# EAGLE design hw-demo03 (EAGLE 7.3.0)
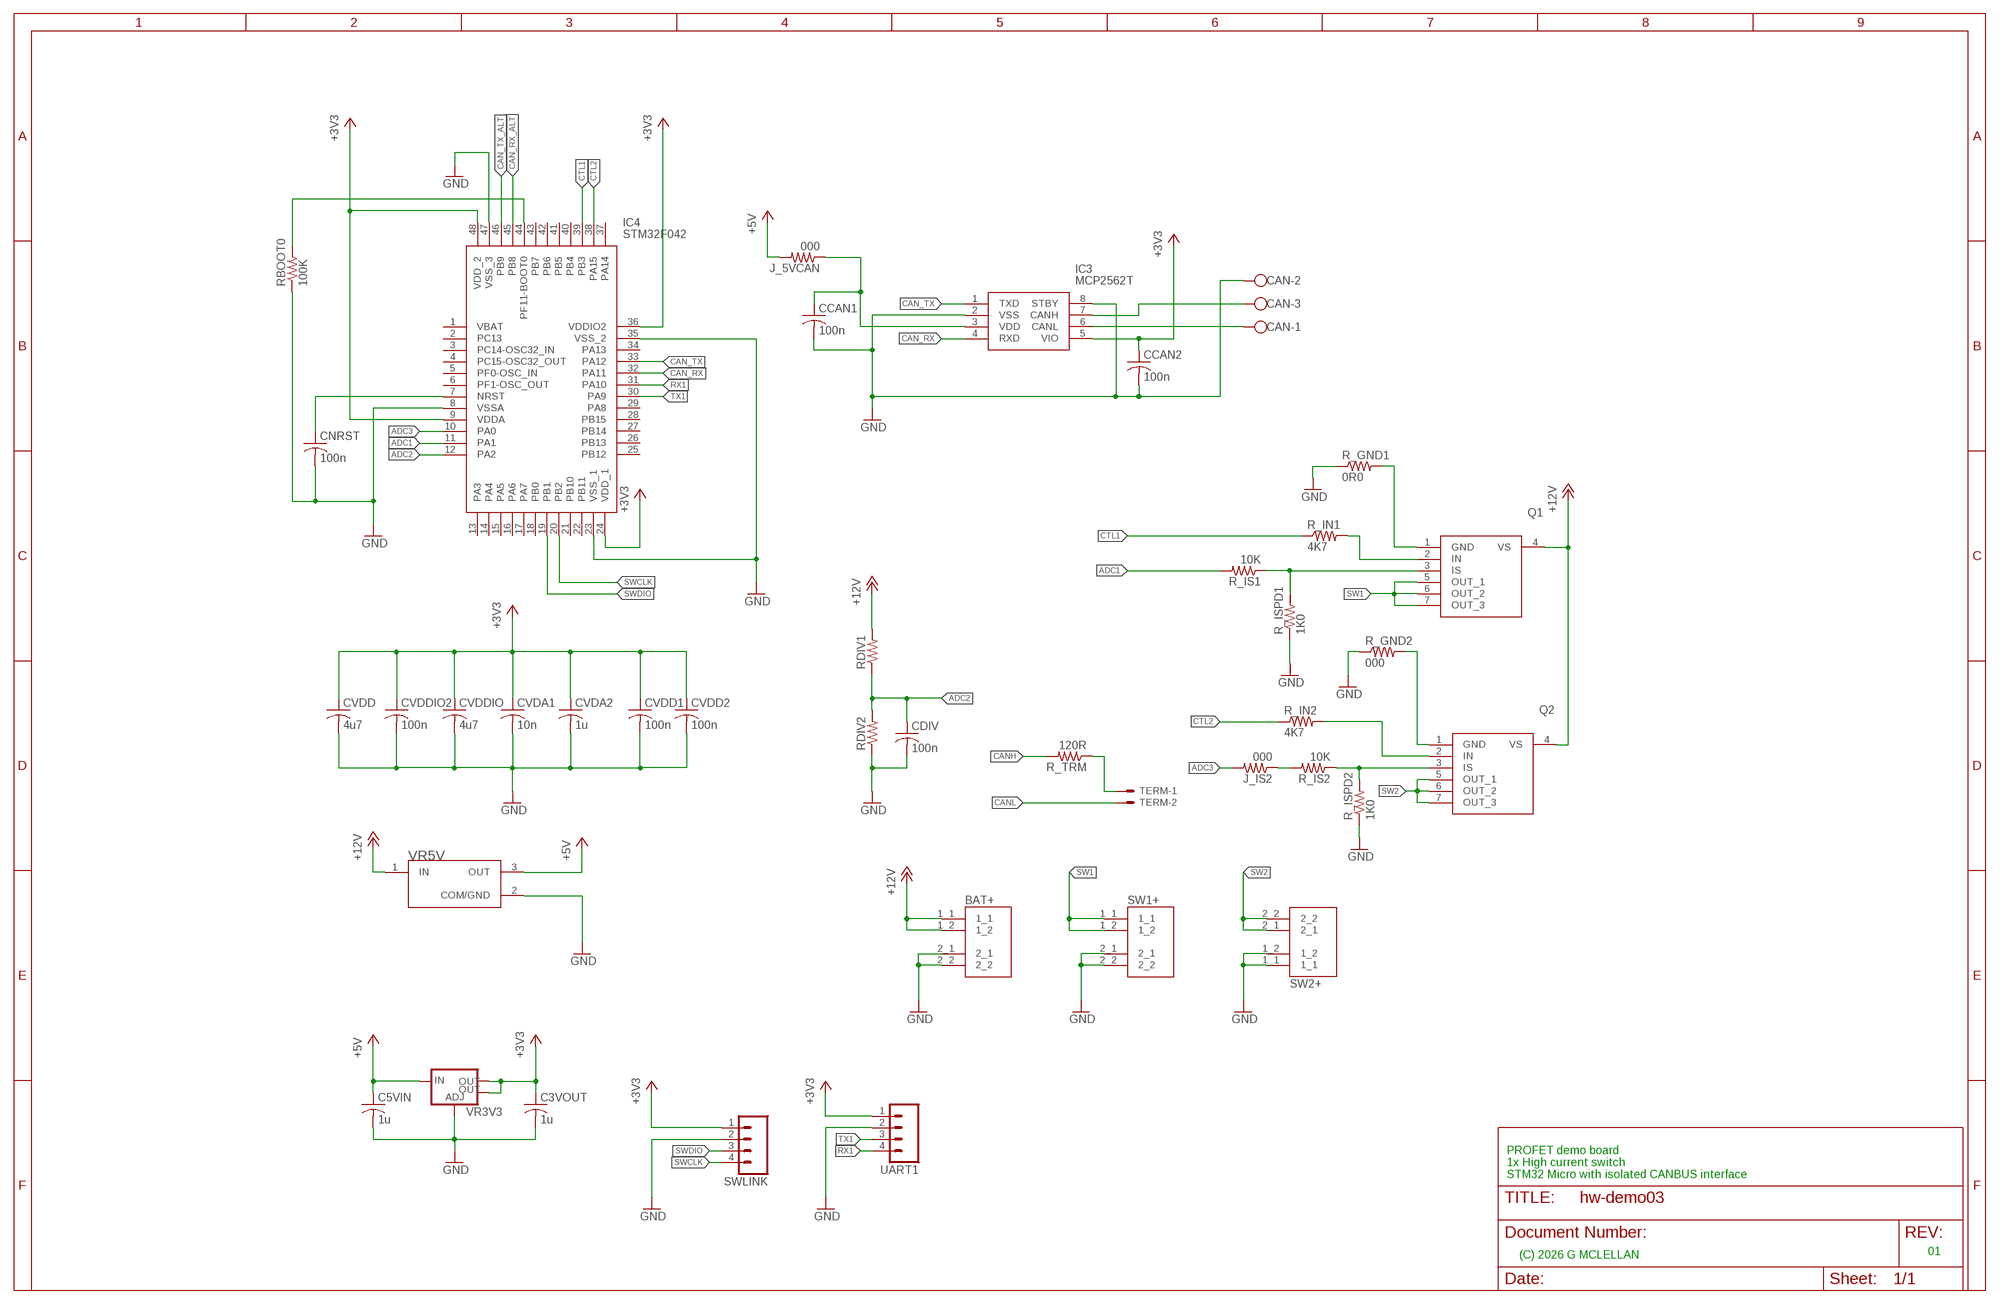
[diagram p0: schematic, sheet 1]

## Parts
BAT+  VP0265840000G  [AMPHENOL_VP0265840000G]
C3VOUT  1u  C-USC0805K  [C0805K]
C5VIN  1u  C-USC1206K  [C1206K]
CAN  W237-103  [W237-103]
CCAN1  100n  C-USC0603K  [C0603K]
CCAN2  100n  C-USC0603K  [C0603K]
CDIV  100n  C-USC0603K  [C0603K]
CNRST  100n  C-USC0603K  [C0603K]
CVDA1  10n  C-USC0603K  [C0603K]
CVDA2  1u  C-USC0603K  [C0603K]
CVDD  4u7  C-USC0603K  [C0603K]
CVDD1  100n  C-USC0603K  [C0603K]
CVDD2  100n  C-USC0603K  [C0603K]
CVDDIO  4u7  C-USC0603K  [C0603K]
CVDDIO2  100n  C-USC0603K  [C0603K]
IC3  MCP2562T  MCP2562T-H_SN  [SOIC127P600X175-8N]
IC4  STM32F042  STM32F042C6T7  [QFP50P900X900X160-48N]
J_5VCAN  000  R-US_0207/15  [0207/15]
J_IS2  000  R-US_0207/15  [0207/15]
Q1  BTS500101TADATMA2  [BTS500101TADATMA2]
Q2  BTS500101TADATMA2  [BTS500101TADATMA2]
R_GND1  0R0  R-US_R1206W  [R1206W]
R_GND2  000  R-US_R1206W  [R1206W]
R_IN1  4K7  R-US_0207/10  [0207/10]
R_IN2  4K7  R-US_0204/7  [0204/7]
R_IS1  10K  R-US_0204/7  [0204/7]
R_IS2  10K  R-US_0204/7  [0204/7]
R_ISPD1  1K0  R-US_0204/7  [0204/7]
R_ISPD2  1K0  R-US_0204/7  [0204/7]
R_TRM  120R  R-US_0204/7  [0204/7]
RBOOT0  100K  R-US_R0603  [R0603]
RDIV1  R-US_R0805  [R0805]
RDIV2  R-US_R0805  [R0805]
SW1+  VP0265840000G  [AMPHENOL_VP0265840000G]
SW2+  VP0265840000G  [AMPHENOL_VP0265840000G]
SWLINK  M04LOCK  [1X04_LOCK]
TERM  22-23-2021  [22-23-2021]
UART1  M04LOCK  [1X04_LOCK]
VR3V3  V_REG_LM1117SOT223  [SOT223]
VR5V  OKI-78SR-5/1.5-W36-C  [CONV_OKI-78SR-5/1.5-W36-C]

## Nets
+3V3: C3VOUT.1 CCAN2.1 CVDA1.1 CVDA2.1 CVDD1.1 CVDD2.1 CVDD.1 CVDDIO2.1 CVDDIO.1 IC3.5(VIO) IC4.9(VDDA) IC4.24(VDD_1) IC4.36(VDDIO2) IC4.48(VDD_2) SWLINK.1 UART1.1 VR3V3.2(OUT) VR3V3.4(OUT)
+5V: C5VIN.1 J_5VCAN.2 VR3V3.3(IN) VR5V.3(OUT)
+12V: BAT+.1_1 BAT+.1_2 Q1.4(VS) Q2.4(VS) RDIV1.2 VR5V.1(IN)
ADC1: IC4.11(PA1) R_IS1.2
ADC2: CDIV.1 IC4.12(PA2) RDIV1.1 RDIV2.2
ADC3: IC4.10(PA0) J_IS2.2
BOOT0: IC4.44(PF11-BOOT0) RBOOT0.2
CAN_RX: IC3.4(RXD) IC4.32(PA11)
CAN_RX_ALT: IC4.45(PB8)
CAN_TX: IC3.1(TXD) IC4.33(PA12)
CAN_TX_ALT: IC4.46(PB9)
CANH: CAN.3 IC3.7(CANH) R_TRM.2
CANL: CAN.1 IC3.6(CANL) TERM.2
CTL1: IC4.39(PB3) R_IN1.1
CTL2: IC4.38(PA15) R_IN2.1
CTL3`: Q1.2(IN) R_IN1.2
GND: BAT+.2_1 BAT+.2_2 C3VOUT.2 C5VIN.2 CAN.2 CCAN1.2 CCAN2.2 CDIV.2 CNRST.2 CVDA1.2 CVDA2.2 CVDD1.2 CVDD2.2 CVDD.2 CVDDIO2.2 CVDDIO.2 IC3.2(VSS) IC3.8(STBY) IC4.8(VSSA) IC4.23(VSS_1) IC4.35(VSS_2) IC4.47(VSS_3) R_GND1.1 R_GND2.1 R_ISPD1.1 R_ISPD2.1 RBOOT0.1 RDIV2.1 SW1+.2_1 SW1+.2_2 SW2+.1_1 SW2+.1_2 SWLINK.2 UART1.2 VR3V3.1(ADJ) VR5V.2(COM/GND)
IS: Q1.3(IS) R_IS1.1 R_ISPD1.2
N$1: R_TRM.1 TERM.1
N$2: J_IS2.1 R_IS2.2
N$3: Q1.1(GND) R_GND1.2
N$4: Q2.1(GND) R_GND2.2
N$5: Q2.2(IN) R_IN2.2
N$6: Q2.3(IS) R_IS2.1 R_ISPD2.2
N$7: CCAN1.1 IC3.3(VDD) J_5VCAN.1
N$8: CNRST.1 IC4.7(NRST)
RX1: IC4.31(PA10) UART1.4
SW1: Q1.5(OUT_1) Q1.6(OUT_2) Q1.7(OUT_3) SW1+.1_1 SW1+.1_2
SW2: Q2.5(OUT_1) Q2.6(OUT_2) Q2.7(OUT_3) SW2+.2_1 SW2+.2_2
SWCLK: IC4.20(PB2) SWLINK.4
SWDIO: IC4.19(PB1) SWLINK.3
TX1: IC4.30(PA9) UART1.3
Unconnected: IC4.1(VBAT) IC4.2(PC13) IC4.3(PC14-OSC32_IN) IC4.4(PC15-OSC32_OUT) IC4.5(PF0-OSC_IN) IC4.6(PF1-OSC_OUT) IC4.13(PA3) IC4.14(PA4) IC4.15(PA5) IC4.16(PA6) IC4.17(PA7) IC4.18(PB0) IC4.21(PB10) IC4.22(PB11) IC4.25(PB12) IC4.26(PB13) IC4.27(PB14) IC4.28(PB15) IC4.29(PA8) IC4.34(PA13) IC4.37(PA14) IC4.40(PB4) IC4.41(PB5) IC4.42(PB6) IC4.43(PB7)

## Notes on the sheet
- PROFET demo board
  1x High current switch
  STM32 Micro with isolated CANBUS interface
- 01
- (C) 2026 G MCLELLAN

## Library data of the parts
BAT+ SW1+ SW2+ = VP0265840000G:VP0265840000G; MANUFACTURER: Amphenol Anytek; MAXIMUM_PACKAGE_HEIGHT: 28.5mm; PARTREV: J; STANDARD: Manufacturer Recommendations
C3VOUT C5VIN CCAN1 CCAN2 CDIV CNRST CVDA1 CVDA2 CVDD CVDD1 CVDD2 CVDDIO CVDDIO2 = rcl:C-US: CAPACITOR, American symbol
CAN = con-wago-500:W237-103: WAGO SCREW CLAMP; MPN: 237-103; OC_FARNELL: unknown; OC_NEWARK: 18M7116
IC3 = MCP2562T-H_SN:MCP2562T-H_SN: CAN Interface IC Source: Datasheet <https://componentsearchengine.com/Datasheets/1/MCP2562T-H_SN.pdf>; DESCRIPTION: CAN Interface IC; HEIGHT: 1.75mm; MANUFACTURER_NAME: Microchip; MANUFACTURER_PART_NUMBER: MCP2562T-H/SN; MOUSER_PART_NUMBER: 579-MCP2562T-H/SN; MOUSER_PRICE-STOCK: https://www.mouser.co.uk/ProductDetail/Microchip-Technology/MCP2562T-H-SN?qs=eTPcRhULBzwloCb8Xxk0jQ%3D%3D
IC4 = STM32F042C6T7:STM32F042C6T7: Mainstream Arm Cortex-M0 USB line MCU with 32 Kbytes of Flash memory, 48 MHz CPU, USB, CAN and CEC functions Source: Datasheet <https://www.st.com/resource/en/datasheet/stm32f042c4.pdf>; DESCRIPTION: Mainstream Arm Cortex-M0 USB line MCU with 32 Kbytes of Flash memory, 48 MHz CPU, USB, CAN and CEC functions; HEIGHT: 1.6mm; MANUFACTURER_NAME: STMicroelectronics; MANUFACTURER_PART_NUMBER: STM32F042C6T7; MOUSER_PART_NUMBER: 511-STM32F042C6T7; MOUSER_PRICE-STOCK: https://www.mouser.co.uk/ProductDetail/STMicroelectronics/STM32F042C6T7?qs=PqoDHHvF6499eidad5TESA%3D%3D
J_5VCAN J_IS2 R_GND1 R_GND2 R_IN1 R_IN2 R_IS1 R_IS2 R_ISPD1 R_ISPD2 R_TRM RBOOT0 RDIV1 RDIV2 = rcl:R-US_: RESISTOR, American symbol
Q1 Q2 = BTS500101TADATMA2:BTS500101TADATMA2: Power Switch ICs - Power Distribution MULTICHIP PROFET & GD Source: Datasheet <https://www.infineon.com/assets/row/public/packages/202/footprint_download/infineon-pg-to263-7-10-fpd-pdf-footprint-en.pdf>; DESCRIPTION: Power Switch ICs - Power Distribution MULTICHIP PROFET & GD; HEIGHT: 4.5mm; MANUFACTURER_NAME: Infineon; MANUFACTURER_PART_NUMBER: BTS500101TADATMA2; MOUSER_PART_NUMBER: 726-BTS500101TADATM2; MOUSER_PRICE-STOCK: https://www.mouser.co.uk/ProductDetail/Infineon-Technologies/BTS500101TADATMA2?qs=l7cgNqFNU1huaQviZWv9NQ%3D%3D
SWLINK UART1 = SparkFun-Connectors:M04: Header 4 Standard 4-pin 0.1" header. Use with straight break away headers (SKU : PRT-00116), right angle break away headers (PRT-00553), swiss pins (PRT-00743), machine pins (PRT-00117), and female headers (PRT-00115). Molex polarized connector foot print use with SKU : PRT-08231 with associated crimp pins and housings. 1MM SMD Version SKU: PRT-10208; PROD_ID: CONN-09696
TERM = con-molex:22-23-2021: .100" (2.54mm) Center Header - 2 Pin; MF: MOLEX; MPN: 22-23-2021; OC_FARNELL: 1462926; OC_NEWARK: 25C3832
VR3V3 = SparkFun-PowerIC:V_REG_LM1117: Voltage Regulator LM1117 Standard adjustable voltage regulator but in SMD form. Spark Fun Electronics SKU : COM-00595; PROD_ID: VREG-08170
VR5V = OKI-78SR-5_1.5-W36-C:OKI-78SR-5/1.5-W36-C; MANUFACTURER: Murata; MAXIMUM_PACKAGE_HEIGHT: 16.5mm; STANDARD: Manufacturer recommendations

## Board
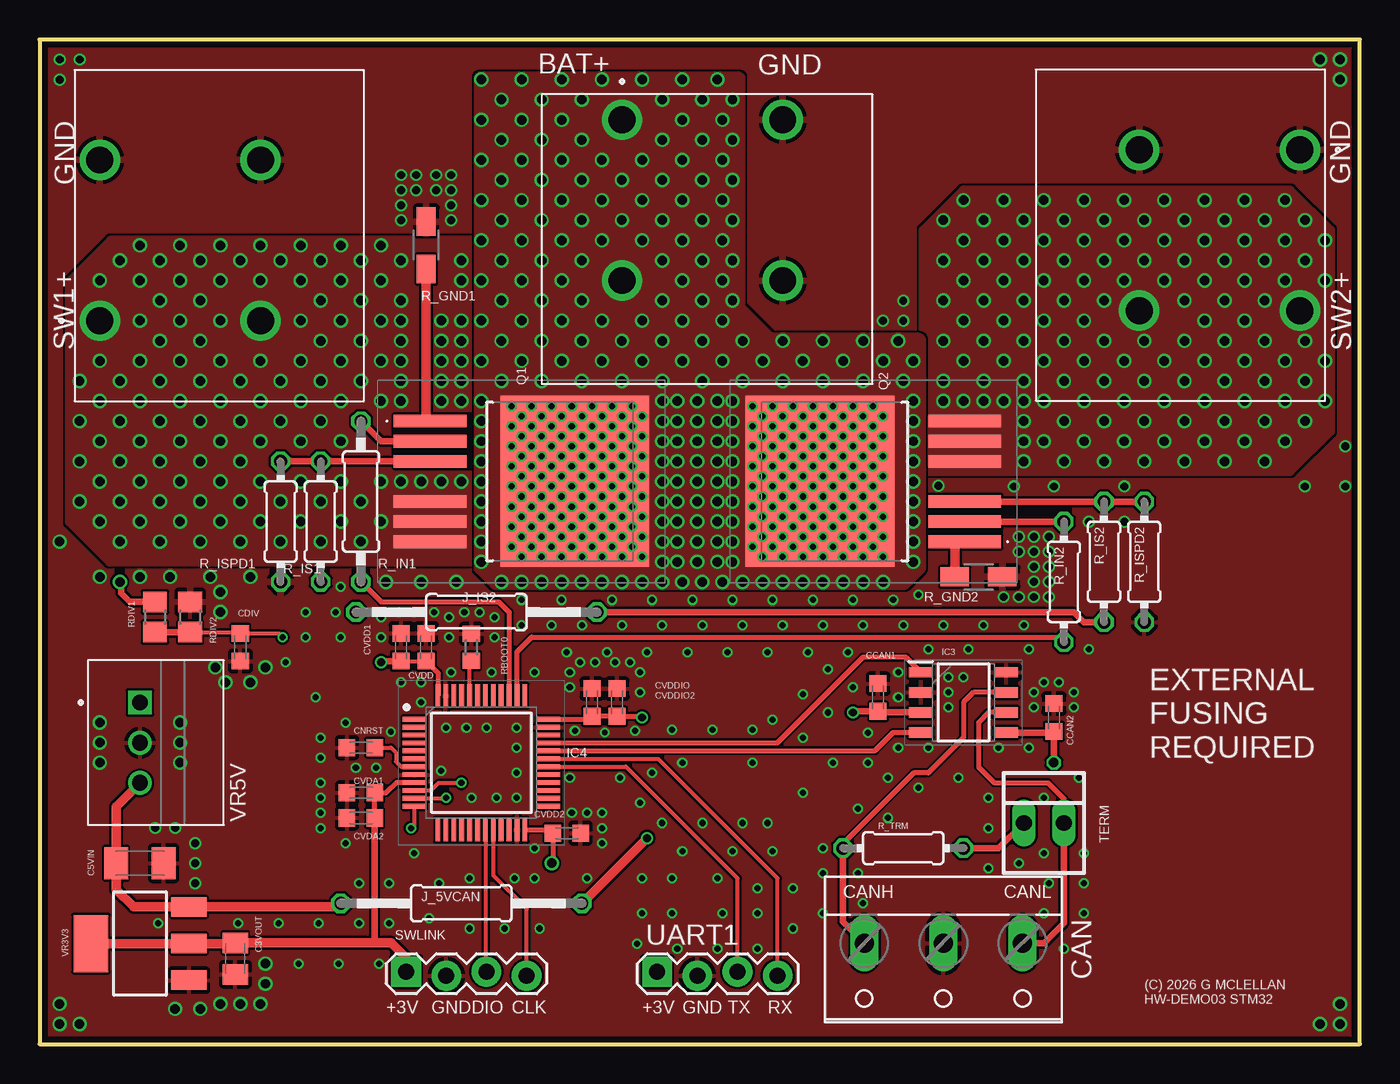
[diagram p1: board, top side]
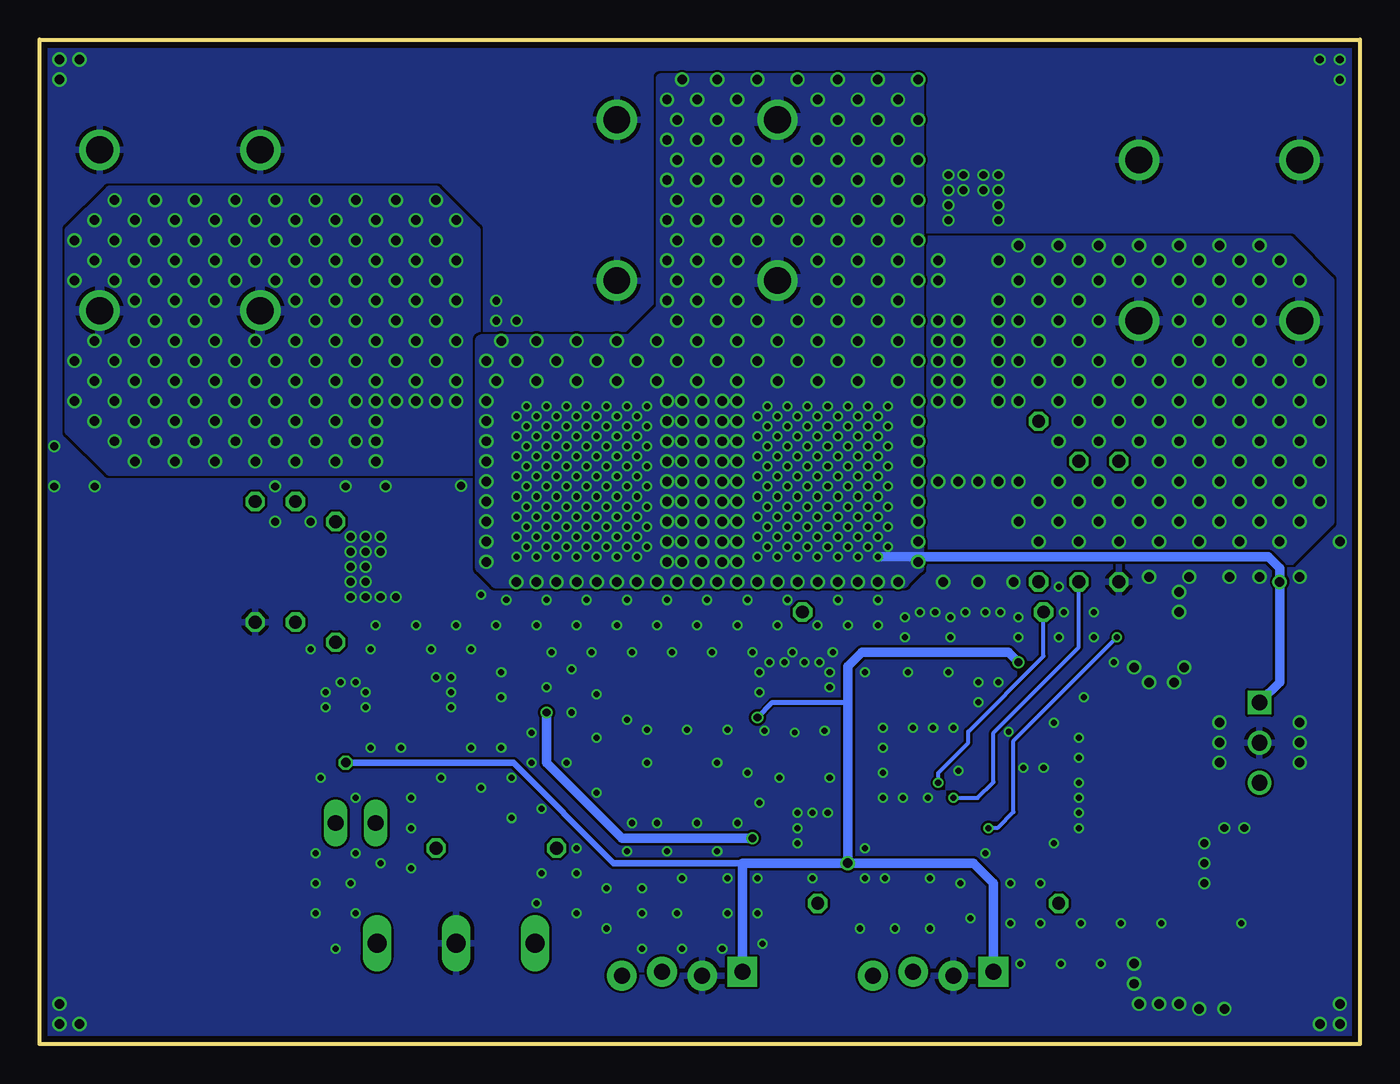
[diagram p2: board, bottom side, seen from below]

Size 83.49 x 63.49 mm. Coordinates in mm from the lower left corner, seen from the top.
Outline: 0,0 83.49,0 83.49,63.49 0,63.49 0,0
Copper layers (1*16): Top 0.035559375mm / dielectric 1.6mm / Bottom 0.035559375mm
Design rules "oshpark-2layer": minimum track width 6mil, minimum drill 10mil, track to track 6mil, track to pad 6mil, pad to pad 6mil, via to via 6mil, smd to smd 6mil, copper to edge 15mil, drill to drill 6mil, minimum pad ring 5mil, minimum via ring 5mil, stop-mask expansion 2.5mil, vias tented up to drill 0mil, thermal gap 10mil

### Footprints (pad centres in the part's own frame; a part is rotated, then mirrored left to right if it is on the bottom)
AMPHENOL_VP0265840000G = drill 1.7: 1_1 -5.08,5.08; 1_2 -5.08,-5.08; 2_1 5.08,5.08; 2_2 5.08,-5.08
C0805K = smd 1.3 x 1.6: 1 -1,0; 2 1,0
C1206K = smd 1.5 x 2: 1 -1.5,0; 2 1.5,0
W237-103 = drill 1.194 long: 1 -5,-1.29; 2 0,-1.29; 3 5,-1.29
C0603K = smd 1.05 x 1.08: 1 -0.875,0; 2 0.875,0
SOIC127P600X175-8N = smd 1.5 x 0.65: 1 -2.7,1.905; 2 -2.7,0.635; 3 -2.7,-0.635; 4 -2.7,-1.905; 5 2.7,-1.905; 6 2.7,-0.635; 7 2.7,0.635; 8 2.7,1.905
QFP50P900X900X160-48N = smd 1.475 x 0.3: 1 -4.238,2.75; 2 -4.238,2.25; 3 -4.238,1.75; 4 -4.238,1.25; 5 -4.238,0.75; 6 -4.238,0.25; 7 -4.238,-0.25; 8 -4.238,-0.75; 9 -4.238,-1.25; 10 -4.238,-1.75; 11 -4.238,-2.25; 12 -4.238,-2.75; 25 4.238,-2.75; 26 4.238,-2.25; 27 4.238,-1.75; 28 4.238,-1.25; 29 4.238,-0.75; 30 4.238,-0.25; 31 4.238,0.25; 32 4.238,0.75; 33 4.238,1.25; 34 4.238,1.75; 35 4.238,2.25; 36 4.238,2.75 | smd 0.3 x 1.475: 13 -2.75,-4.238; 14 -2.25,-4.238; 15 -1.75,-4.238; 16 -1.25,-4.238; 17 -0.75,-4.238; 18 -0.25,-4.238; 19 0.25,-4.238; 20 0.75,-4.238; 21 1.25,-4.238; 22 1.75,-4.238; 23 2.25,-4.238; 24 2.75,-4.238; 37 2.75,4.238; 38 2.25,4.238; 39 1.75,4.238; 40 1.25,4.238; 41 0.75,4.238; 42 0.25,4.238; 43 -0.25,4.238; 44 -0.75,4.238; 45 -1.25,4.238; 46 -1.75,4.238; 47 -2.25,4.238; 48 -2.75,4.238
0207/15 = drill 0.813 octagon: 1 -7.62,0; 2 7.62,0
BTS500101TADATMA2 = smd 0.8 x 4.6: 1 -3.81,-6.425; 2 -2.54,-6.425; 3 -1.27,-6.425; 5 1.27,-6.425; 6 2.54,-6.425; 7 3.81,-6.425 | smd 10.8 x 9.4: 4 0,2.725
R1206W = smd 1.8 x 1.2: 1 -1.499,0; 2 1.499,0
0207/10 = drill 0.813 octagon: 1 -5.08,0; 2 5.08,0
0204/7 = drill 0.813 octagon: 1 -3.81,0; 2 3.81,0
R0603 = smd 1 x 1.1: 1 -0.85,0; 2 0.85,0
R0805 = smd 1.3 x 1.5: 1 -0.95,0; 2 0.95,0
1X04_LOCK = drill 1.016 pad 1.88 square: 1 0,0.127 | drill 1.016 pad 1.88: 2 2.54,-0.127; 3 5.08,0.127; 4 7.62,-0.127
22-23-2021 = drill 1 long: 1 -1.27,0; 2 1.27,0
SOT223 = smd 1.219 x 2.235: 1 -2.311,-3.099; 2 0,-3.099; 3 2.311,-3.099 | smd 3.6 x 2.2: 4 0,3.099
CONV_OKI-78SR-5/1.5-W36-C = drill 1 pad 1.5 square: 1 -2.54,0 | drill 1 pad 1.5: 2 0,0; 3 2.54,0

### Placement (x,y rotation side)
BAT+  41.91,53.34 0 top
C3VOUT  12.38,5.4 270 top
C5VIN  6.35,11.43 0 top
CAN  57.15,5.08 180 top
CCAN1  53.02,21.91 90 top
CCAN2  64.14,20.64 90 top
CDIV  12.7,25.08 270 top
CNRST  20.32,18.73 180 top
CVDA1  20.32,15.88 180 top
CVDA2  20.32,14.29 180 top
CVDD  24.45,25.08 90 top
CVDD1  22.86,25.08 90 top
CVDD2  33.34,13.34 0 top
CVDDIO  36.51,21.59 90 top
CVDDIO2  34.92,21.59 90 top
IC3  58.42,21.59 0 top
IC4  27.94,17.78 0 top
J_5VCAN  26.67,8.89 180 top
J_IS2  27.62,27.3 180 top
Q1  31.11,35.56 270 top
Q2  52.07,35.56 90 top
R_GND1  24.45,50.48 270 top
R_GND2  59.37,29.53 180 top
R_IN1  20.32,34.29 90 top
R_IN2  64.77,29.21 90 top
R_IS1  17.78,33.02 270 top
R_IS2  67.31,30.48 270 top
R_ISPD1  15.24,33.02 90 top
R_ISPD2  69.85,30.48 90 top
R_TRM  54.61,12.38 180 top
RBOOT0  27.3,25.08 270 top
RDIV1  7.3,26.99 90 top
RDIV2  9.53,26.99 270 top
SW1+  8.89,50.8 90 top
SW2+  74.61,51.44 270 top
SWLINK  23.18,4.45 0 top
TERM  63.5,13.97 0 top
UART1  39.05,4.45 0 top
VR3V3  6.35,6.35 90 top
VR5V  6.35,19.05 270 top

### Tracks (layer width: path | path; a pad name or v marks a point on that pad's centre or on a via)
+3V3  (via drill 0.5, 0.6)
  Top 0.254: CVDD1.1 CVDD.1
  Top 0.305: IC4.24 32.26,13.54 CVDD2.1 32.46,11.51 v32.38,11.43 | IC4.9 22.56,16.53 21.91,15.88 CVDA1.1 CVDA2.1 | CVDD.1 25.19,23.46 IC4.48 | 34.74,20.53 CVDDIO2.1 | CVDDIO2.1 CVDDIO.1 38.1,20.71 v38.1,20.64 | IC4.36 34.92,20.53 CVDDIO2.1
  Top 0.406: CVDD2.1 32.38,13.34 | v64.14,17.78 CCAN2.1 64.06,19.68 IC3.5 | 9.45,6.27 VR3V3.2 | CVDA2.1 21.2,6.4 21.59,6.4 | CVDD1.1 21.59,24.21 v21.59,24.13
  Top 0.61: VR3V3.4 VR3V3.2 12.38,6.35 C3VOUT.1 21.59,6.4 22.25,6.4 23.18,5.46 SWLINK.1
  Bottom 0.305: v38.1,20.64 37.15,21.59 32.38,21.59
  Bottom 0.406: 39.05,11.43 47.18,11.43 53.53,17.78 v64.14,17.78
  Bottom 0.61: v32.38,11.43 24.45,11.43 23.18,10.16 SWLINK.1 | v32.38,11.43 39.05,11.43 UART1.1 | v32.38,11.43 32.38,21.59 32.38,23.87 31.49,24.77 22.23,24.77 v21.59,24.13
+5V
  Top 0.61: J_5VCAN.2 18.82,8.66 VR3V3.3 5.94,8.66 4.85,9.76 C5VIN.1 4.85,15.01 VR5V.3
+12V  (via drill 0.38, 0.6)
  Top 0.305: RDIV1.2
  Top 0.406: 5.17,29.21 5.17,28.49 5.71,27.94 RDIV1.2
  Top 0.61: v5.08,29.21 5.17,29.21
  Bottom 0.61: v30.48,30.8 5.79,30.8 5.08,30.09 v5.08,29.21 5.08,22.86 VR5V.1
  other vias: 29.21,59.69 31.75,59.69 34.29,59.69 39.37,59.69 41.91,59.69 43.18,58.42 40.64,58.42 33.02,58.42 30.48,58.42 29.21,57.15 31.75,57.15 34.29,57.15 39.37,57.15 41.91,57.15 43.18,55.88 40.64,55.88 38.1,55.88 35.56,55.88 33.02,55.88 30.48,55.88 29.21,54.61 31.75,54.61 34.29,54.61 36.83,54.61 39.37,54.61 41.91,54.61 43.18,53.34 40.64,53.34 38.1,53.34 35.56,53.34 33.02,53.34 30.48,53.34 29.21,52.07 31.75,52.07 34.29,52.07 36.83,52.07 39.37,52.07 41.91,52.07 43.18,50.8 40.64,50.8 38.1,50.8 35.56,50.8 33.02,50.8 30.48,50.8 29.21,49.53 31.75,49.53 34.29,49.53 39.37,49.53 41.91,49.53 43.18,48.26 40.64,48.26 33.02,48.26 30.48,48.26 29.21,46.99 31.75,46.99 34.29,46.99 39.37,46.99 41.91,46.99 43.18,45.72 40.64,45.72 38.1,45.72 35.56,45.72 33.02,45.72 30.48,45.72 29.21,44.45 31.75,44.45 34.29,44.45 36.83,44.45 39.37,44.45 41.91,44.45 44.45,44.45 30.48,43.18 33.02,43.18 35.56,43.18 38.1,43.18 40.64,43.18 43.18,43.18 45.72,43.18 48.26,43.18 50.8,43.18 53.34,43.18 54.61,41.91 52.07,41.91 49.53,41.91 46.99,41.91 44.45,41.91 41.91,41.91 39.37,41.91 36.83,41.91 34.29,41.91 31.75,41.91 29.21,41.91 40.32,40.64 39.37,39.37 39.37,40.64 42.86,40.64 42.86,39.37 41.59,40.64 40.32,39.37 41.59,39.37 43.81,40.64 43.81,39.37 39.37,38.1 39.37,36.83 39.37,35.56 39.37,34.29 39.37,33.02 39.37,31.75 39.37,30.48 40.32,30.48 41.59,30.48 42.86,30.48 42.86,31.75 41.59,31.75 40.32,31.75 40.32,33.02 41.59,33.02 42.86,33.02 42.86,34.29 41.59,34.29 40.32,34.29 40.32,35.56 41.59,35.56 42.86,35.56 42.86,36.83 41.59,36.83 40.32,36.83 40.32,38.1 41.59,38.1 42.86,38.1 43.81,38.1 43.81,36.83 43.81,35.56 43.81,34.29 43.81,33.02 43.81,31.75 43.81,30.48 55.24,30.48 55.24,31.75 55.24,33.02 55.24,34.29 55.24,35.56 55.24,36.83 55.24,38.1 55.24,39.37 55.24,40.64 27.94,40.64 27.94,39.37 27.94,38.1 27.94,36.83 27.94,35.56 27.94,34.29 27.94,33.02 27.94,31.75 27.94,30.48 29.21,29.21 30.48,29.21 31.75,29.21 33.02,29.21 34.29,29.21 35.56,29.21 36.83,29.21 38.1,29.21 39.37,29.21 40.64,29.21 41.91,29.21 43.18,29.21 44.45,29.21 45.72,29.21 46.99,29.21 48.26,29.21 49.53,29.21 50.8,29.21 52.07,29.21 53.34,29.21 55.24,43.18 29.84,40.32 31.11,40.32 32.38,40.32 33.65,40.32 34.92,40.32 36.2,40.32 37.46,40.32 36.83,39.69 35.56,39.69 34.29,39.69 33.02,39.69 31.75,39.69 30.48,39.69 29.84,39.05 31.11,39.05 32.38,39.05 33.65,39.05 34.92,39.05 36.2,39.05 37.46,39.05 38.1,39.69 38.1,38.42 36.83,38.42 35.56,38.42 34.29,38.42 33.02,38.42 31.75,38.42 30.48,38.42 29.84,37.78 31.11,37.78 32.38,37.78 33.65,37.78 34.92,37.78 36.2,37.78 37.46,37.78 38.1,37.15 36.83,37.15 35.56,37.15 34.29,37.15 33.02,37.15 31.75,37.15 30.48,37.15 29.84,36.51 31.11,36.51 32.38,36.51 33.65,36.51 34.92,36.51 36.2,36.51 37.46,36.51 38.1,35.88 36.83,35.88 35.56,35.88 34.29,35.88 33.02,35.88 31.75,35.88 30.48,35.88 37.46,35.24 38.1,34.61 36.2,35.24 36.83,34.61 35.56,34.61 34.92,35.24 33.65,35.24 34.29,34.61 32.38,35.24 33.02,34.61 31.11,35.24 31.75,34.61 30.48,34.61 29.84,35.24 29.84,33.97 31.11,33.97 32.38,33.97 33.65,33.97 34.92,33.97 36.2,33.97 37.46,33.97 38.1,33.34 36.83,33.34 35.56,33.34 34.29,33.34 33.02,33.34 31.75,33.34 30.48,33.34 29.84,32.7 31.11,32.7 32.38,32.7 33.65,32.7 34.92,32.7 36.2,32.7 37.46,32.7 38.1,32.07 36.83,32.07 35.56,32.07 34.29,32.07 33.02,32.07 31.75,32.07 30.48,32.07 29.84,31.43 31.11,31.43 32.38,31.43 33.65,31.43 34.92,31.43 36.2,31.43 37.46,31.43 38.1,30.8 36.83,30.8 35.56,30.8 34.29,30.8 33.02,30.8 31.75,30.8 45.08,40.32 46.35,40.32 45.72,39.69 46.99,39.69 47.62,40.32 48.26,39.69 48.89,40.32 49.53,39.69 50.16,40.32 50.8,39.69 51.43,40.32 52.07,39.69 52.7,40.32 53.34,39.69 52.7,39.05 53.34,38.42 51.43,39.05 52.07,38.42 52.7,37.78 50.16,39.05 48.89,39.05 47.62,39.05 46.35,39.05 45.08,39.05 45.72,38.42 46.99,38.42 48.26,38.42 49.53,38.42 50.8,38.42 51.43,37.78 50.16,37.78 48.89,37.78 47.62,37.78 46.35,37.78 45.08,37.78 45.72,37.15 46.99,37.15 48.26,37.15 49.53,37.15 50.8,37.15 52.07,37.15 53.34,37.15 45.08,36.51 46.35,36.51 47.62,36.51 48.89,36.51 50.16,36.51 51.43,36.51 52.7,36.51 53.34,35.88 52.07,35.88 50.8,35.88 49.53,35.88 48.26,35.88 46.99,35.88 45.72,35.88 45.08,35.24 46.35,35.24 47.62,35.24 48.89,35.24 50.16,35.24 51.43,35.24 52.7,35.24 53.34,34.61 52.07,34.61 50.8,34.61 49.53,34.61 48.26,34.61 46.99,34.61 45.72,34.61 45.08,33.97 46.35,33.97 47.62,33.97 48.89,33.97 50.16,33.97 51.43,33.97 52.7,33.97 53.34,33.34 52.07,33.34 50.8,33.34 49.53,33.34 48.26,33.34 46.99,33.34 45.72,33.34 45.08,32.7 46.35,32.7 47.62,32.7 48.89,32.7 50.16,32.7 51.43,32.7 52.7,32.7 53.34,32.07 52.07,32.07 50.8,32.07 49.53,32.07 48.26,32.07 46.99,32.07 45.72,32.07 45.08,31.43 46.35,31.43 47.62,31.43 48.89,31.43 50.16,31.43 51.43,31.43 52.7,31.43 53.34,30.8 52.07,30.8 50.8,30.8 49.53,30.8 48.26,30.8 46.99,30.8 45.72,30.8 54.29,44.45 52.07,44.45 49.53,44.45 46.99,44.45 43.81,52.07 43.81,54.61 43.81,57.15 43.81,59.69 42.86,60.96 40.64,60.96 38.1,60.96 35.56,60.96 33.02,60.96 30.48,60.96 27.94,60.96 27.94,58.42 27.94,55.88 27.94,53.34 27.94,50.8 27.94,48.26 27.94,45.72 27.94,43.18 43.81,49.53 43.81,46.99
  pour Top (rank 3, no thermals): 27.94,60.96 27.94,30.16 28.89,29.21 54.61,29.21 55.56,30.16 55.56,44.45 46.17,44.45 44.13,46.48 44.13,60.96
  pour Bottom (rank 3): 27.94,60.96 44.13,60.96 44.13,46.48 46.17,44.45 55.56,44.45 55.56,30.16 54.61,29.21 28.89,29.21 27.94,30.16
ADC1  (via drill 0.38)
  Top 0.254: IC4.11 25.72,15.53 v25.72,15.56
  Bottom 0.254: v25.72,15.56 24.18,15.56 23.18,16.56 23.18,19.68 17.78,25.08 R_IS1.2
ADC2  (via drill 0.38)
  Top 0.254: v23.5,13.65 23.7,13.86 IC4.12 | RDIV2.2 12.7,26.04 CDIV.1 15.12,25.96 v15.36,25.72
  Top 0.406: RDIV1.1 RDIV2.2
  Bottom 0.254: v23.5,13.65 22.93,13.65 21.91,14.68 21.91,19.17 v15.36,25.72
ADC3  (via drill 0.38)
  Top 0.254: IC4.10 24.77,16.03 25.25,16.51 v26.67,16.51
  Bottom 0.254: v26.67,16.51 26.67,17.14 24.77,19.05 24.77,19.75 20,24.51 J_IS2.2
BOOT0
  Top 0.254: IC4.44 27.19,24.12 RBOOT0.2
CAN_RX
  Top 0.305: IC4.32 52.82,18.53 53.97,19.68 IC3.4
CAN_TX
  Top 0.305: IC4.33 46.65,19.03 52.07,24.45 54.77,24.45 IC3.1
CANH
  Top 0.305: IC3.7 59.05,22.23 58.42,21.59 58.42,19.37 56.2,17.14 55.3,17.14 50.8,12.65 R_TRM.2
  Top 0.406: CAN.3 50.8,7.72 R_TRM.2
CANL
  Top 0.305: IC3.6 60.01,20.95 59.37,20.32 59.37,17.51 60.38,16.51 63.77,16.51 64.77,15.51 TERM.2
  Top 0.406: CAN.1 63.5,6.37 64.77,7.64 TERM.2
CTL1
  Top 0.305: R_IN1.1 21.59,27.94 29.04,27.94 29.69,27.29 IC4.39
CTL2
  Top 0.305: IC4.38 30.19,24.79 31.11,25.72 64.45,25.72 R_IN2.1
CTL3`
  Top 0.406: Q1.2 21.59,38.1 R_IN1.2
GND  (via drill 0.36, 0.38, 0.5, 0.6)
  other vias: 31.31,23.5 39.37,13.97 33.65,14.61 51.43,22.54 21.59,25.72 38.73,17.14 40.64,17.78 58.42,23.18 50.16,17.78 45.08,17.78 48.26,19.37 49.85,20.95 52.39,19.68 46.35,20.51 41.91,13.97 45.4,6.03 46.04,13.97 53.66,14.29 58.1,16.83 55.56,16.19 25.91,25.72 25.72,20 30.16,20 25.4,17.27 30.16,15.56 11.43,2.54 12.7,2.54 13.97,2.54 26.04,23.5 17.78,13.65 17.78,16.51 17.78,18.1 20,17.46 21.27,17.46 28.57,23.5 21.91,29.21 26.35,29.21 48.26,22.1 49.85,23.69 56.2,24.96 56.2,18.73 54.29,18.73 33.53,22.54 24.13,21.59 22.86,22.86 19.05,25.72 18.73,27.3 19.05,28.89 25.91,26.99 28.77,26.99 21.59,26.99 22.23,19.74 16.83,25.72 11.43,27.3 8.26,29.53 19.37,20.32 19.37,12.7 17.78,14.61 17.78,15.56 17.78,19.37 26.99,20 28.26,20 30.16,18.73 30.16,17.14 28.89,15.56 27.3,15.56 24.13,22.86 10.16,2.22 8.57,2.22 14.29,3.81 14.29,5.08 10.79,29.53 61.91,31.11 62.87,31.11 62.87,30.16 62.87,29.21 62.87,28.26 61.91,28.26 22.86,52.07 22.86,53.02 22.86,54.93 23.81,54.93 25.08,54.93 23.81,53.98 22.86,53.98 25.08,53.98 26.04,53.02 26.04,52.07 26.04,53.98 26.04,54.93 63.82,31.11 63.82,30.16 63.82,29.21 63.82,28.26 60.96,28.26 24.13,29.21 13.34,29.53 6.35,29.53 3.81,29.53 1.27,31.75 61.59,35.24 56.83,35.28 64.14,35.24 68.58,35.24 66.36,33.02 68.58,33.02 61.91,32.07 62.87,32.07 63.82,32.07 80.01,35.24 82.55,35.24 82.55,37.78 16.83,27.3 15.56,24.13 17.46,21.91 33.34,24.77 35.88,24.77 38.42,24.77 40.96,24.77 43.5,24.77 46.04,24.77 48.58,24.77 36.83,26.48 39.37,26.48 41.91,26.48 44.45,26.48 46.99,26.48 49.53,26.48 52.07,26.48 54.61,26.48 57.15,26.48 59.69,26.48 62.23,26.48 58.74,24.96 62.55,24.96 55.56,28.38 53.97,28.07 51.43,28.07 48.89,28.07 46.35,28.07 43.81,28.07 41.27,28.07 38.73,28.07 36.2,28.07 33.02,28.07 30.48,28.07 49.53,10.79 49.53,8.26 47.62,7.3 47.62,9.84 45.4,8.26 45.4,9.84 42.86,10.48 43.18,8.26 40,10.48 38.1,10.48 38.1,8.26 40.32,6.03 60.64,18.73 62.55,18.73 62.87,21.27 62.87,22.23 63.5,22.86 65.41,22.23 65.41,21.27 64.45,22.86 34.61,14.61 35.56,14.61 35.56,13.65 35.56,12.7 34.61,10.48 40,8.26 42.86,6.03 37.78,6.35 51.75,10.79 52.07,8.89 63.5,8.26 63.82,10.16 63.5,12.06 66.04,12.06 66.04,10.16 66.04,8.26 64.77,6.03 65.72,16.83 60.01,15.56 63.5,15.56 60.01,13.65 60.01,11.11 61.91,11.43 33.53,23.5 34.16,24.13 35.12,24.13 36.39,24.13 37.34,24.13 37.97,23.5 37.97,22.23 26.86,27.3 27.81,27.3 28.77,25.72 23.69,27.3 24.96,27.3 22.73,27.3 33.85,19.81 35.75,19.68 37.66,19.81 33.53,16.83 36.7,16.83 37.97,15.24 31.31,12.38 31.31,10.48 30.04,10.48 31.62,7.3 29.4,7.3 27.18,7.3 27.18,10.48 23.69,12.06 22.1,10.16 22.1,7.62 24.64,7.94 25.27,10.16 45.08,19.88 42.54,19.88 40,19.88 51.12,24.77 1.27,1.27 1.27,2.54 2.54,1.27 82.23,1.27 80.96,1.27 82.23,2.54 82.23,62.23 82.23,60.96 80.96,62.23 2.54,62.23 11.11,23.81 14.29,23.81 11.75,22.86 13.34,22.86 1.27,62.23 1.27,60.96 20.19,7.62 17.65,7.62 15.11,7.62 12.57,7.62 7.49,7.62 16.38,5.08 18.92,5.08 21.46,5.08 20.19,10.16 54.29,21.91 54.29,23.5 57.47,22.23 57.47,23.18 57.47,21.27 54.61,45.72 54.61,46.99 53.34,45.72 66.36,24.96 40.64,12.19 43.81,12.19 46.35,12.19 52.39,17.78 48.26,15.88 49.53,12.38 53.66,16.83 51.75,14.86 34.29,26.48 32.38,26.48 30.48,26.48 44.45,13.97 8.89,19.05 8.89,20.32 8.89,17.78 3.81,19.05 3.81,20.32 3.81,17.78 9.84,10.16 9.84,11.43 9.84,12.7 7.3,13.65 8.57,13.65 11.43,28.57
  pour Bottom (rank 6): 0,63.5 83.5,63.5 83.5,0 0,0
  pour Top (rank 6): 0,63.5 83.5,63.5 83.5,27.94 0,27.94
  pour Top (rank 5): 0,29.21 83.5,29.21 83.5,0.32 0,0.32
IS
  Top 0.406: Q1.3 R_IS1.1 R_ISPD1.2
N$1
  Top 0.406: R_TRM.1 60.64,12.38 TERM.1
N$2
  Top 0.406: J_IS2.1 65.41,27.3 66.04,26.67 R_IS2.2
N$3
  Top 0.61: R_GND1.2 24.45,39.37 Q1.1
N$4
  Top 0.406: 57.87,31.75 Q2.1
  Top 0.61: R_GND2.2 57.87,31.75
N$5
  Top 0.406: R_IN2.2 Q2.2
N$6
  Top 0.406: R_ISPD2.2 R_IS2.1 Q2.3
N$7  (via drill 0.5)
  Top 0.406: v51.43,20.95 51.43,21.03 CCAN1.1 53.42,20.95 IC3.3
  Top 0.61: J_5VCAN.1 v38.42,13.02
  Bottom 0.61: v51.43,20.95 51.43,17.78 46.67,13.02 v38.42,13.02
N$8
  Top 0.254: IC4.7 22.87,17.53 22.54,17.86 22.54,18.41 22.23,18.73 CNRST.1
RX1
  Top 0.254: IC4.31 39.12,18.03 46.67,10.48 UART1.4
SW1  (via drill 0.6)
  other vias: 26.67,49.53 5.08,49.53 7.62,49.53 10.16,49.53 12.7,49.53 15.24,49.53 17.78,49.53 20.32,49.53 22.86,49.53 3.81,48.26 6.35,48.26 8.89,48.26 11.43,48.26 13.97,48.26 16.51,48.26 19.05,48.26 21.59,48.26 26.67,48.26 26.67,45.72 25.4,45.72 22.86,45.72 22.86,46.99 20.32,46.99 17.78,46.99 10.16,46.99 7.62,46.99 21.59,45.72 25.4,44.45 26.67,44.45 26.67,43.18 25.4,43.18 25.4,41.91 26.67,41.91 26.67,40.64 25.4,40.64 22.86,40.64 22.86,41.91 22.86,43.18 22.86,44.45 19.05,45.72 16.51,45.72 11.43,45.72 8.89,45.72 6.35,45.72 20.32,44.45 17.78,44.45 10.16,44.45 7.62,44.45 3.81,43.18 6.35,43.18 8.89,43.18 11.43,43.18 13.97,43.18 16.51,43.18 19.05,43.18 21.59,43.18 20.32,41.91 17.78,41.91 15.24,41.91 12.7,41.91 10.16,41.91 7.62,41.91 5.08,41.91 2.54,41.91 3.81,40.64 6.35,40.64 8.89,40.64 11.43,40.64 13.97,40.64 16.51,40.64 19.05,40.64 2.54,39.37 5.08,39.37 7.62,39.37 10.16,39.37 12.7,39.37 15.24,39.37 17.78,39.37 3.81,38.1 6.35,38.1 8.89,38.1 11.43,38.1 13.97,38.1 16.51,38.1 2.54,36.83 5.08,36.83 7.62,36.83 10.16,36.83 12.7,36.83 3.81,35.56 6.35,35.56 8.89,35.56 11.43,35.56 13.97,35.56 26.67,35.56 25.4,35.56 24.13,35.56 22.86,35.56 2.54,34.29 5.08,34.29 3.81,33.02 7.62,34.29 6.35,33.02 10.16,34.29 8.89,33.02 12.7,34.29 11.43,33.02 15.24,34.29 13.97,33.02 16.51,35.56 17.78,34.29 19.05,35.56 20.32,34.29 21.59,35.56 19.05,38.1 5.08,31.75 7.62,31.75 10.16,31.75 12.7,31.75 15.24,31.75 17.78,31.75 20.32,31.75 19.05,33.02 16.51,33.02 21.59,33.02 21.59,40.64 6.35,50.48 8.89,50.48 11.43,50.48 13.97,50.48 16.51,50.48 19.05,50.48 21.59,50.48
  pour Top (rank 4, no thermals): 1.9,33.02 1.9,48.18 4.52,50.8 27.62,50.8 27.62,30.48 4.45,30.48
  pour Bottom (rank 4): 1.9,33.02 1.9,48.26 4.45,50.8 27.62,50.8 27.94,30.48 4.45,30.48
SW2  (via drill 0.6)
  other vias: 58.42,53.34 60.96,53.34 63.5,53.34 66.04,53.34 68.58,53.34 71.12,53.34 73.66,53.34 76.2,53.34 78.74,53.34 77.47,52.07 80.01,52.07 74.93,52.07 72.39,52.07 69.85,52.07 67.31,52.07 64.77,52.07 62.23,52.07 59.69,52.07 57.15,52.07 58.42,50.8 60.96,50.8 63.5,50.8 66.04,50.8 68.58,50.8 71.12,50.8 73.66,50.8 76.2,50.8 78.74,50.8 81.28,50.8 57.15,49.53 58.42,48.26 59.69,49.53 60.96,48.26 62.23,49.53 63.5,48.26 64.77,49.53 66.04,48.26 67.31,49.53 69.85,49.53 72.39,49.53 71.12,48.26 68.58,48.26 73.66,48.26 74.93,49.53 76.2,48.26 77.47,49.53 78.74,48.26 80.01,49.53 81.28,48.26 57.15,46.99 59.69,46.99 62.23,46.99 64.77,46.99 67.31,46.99 72.39,46.99 74.93,46.99 77.47,46.99 58.42,45.72 57.15,44.45 58.42,43.18 57.15,41.91 58.42,40.64 59.69,44.45 59.69,41.91 60.96,45.72 60.96,43.18 60.96,40.64 62.23,44.45 62.23,41.91 63.5,45.72 63.5,43.18 63.5,40.64 64.77,44.45 66.04,45.72 66.04,43.18 66.04,40.64 64.77,41.91 67.31,44.45 67.31,41.91 68.58,40.64 68.58,43.18 69.85,44.45 69.85,41.91 71.12,40.64 71.12,43.18 72.39,44.45 73.66,45.72 74.93,44.45 76.2,45.72 77.47,44.45 73.66,43.18 72.39,41.91 73.66,40.64 74.93,41.91 76.2,43.18 76.2,40.64 77.47,41.91 78.74,43.18 80.01,44.45 80.01,41.91 78.74,40.64 81.28,43.18 81.28,40.64 62.23,39.37 62.23,38.1 62.23,36.83 59.69,40.64 57.15,40.64 62.23,40.64 64.77,39.37 63.5,38.1 64.77,36.83 66.04,38.1 67.31,39.37 67.31,36.83 68.58,38.1 69.85,39.37 69.85,36.83 71.12,38.1 72.39,39.37 72.39,36.83 73.66,38.1 74.93,39.37 74.93,36.83 76.2,38.1 77.47,39.37 77.47,36.83 78.74,38.1 80.01,39.37
  pour Top (rank 4, no thermals): 81.6,38.73 81.6,51.44 79.06,53.98 58.42,53.98 55.88,51.44 55.88,36.2 79.06,36.2
  pour Bottom (rank 4): 55.88,36.2 55.88,51.44 58.42,53.98 79.06,53.98 81.6,51.44 81.6,38.73 79.06,36.2
SWCLK
  Top 0.254: IC4.20 28.69,10.68 30.8,8.57 SWLINK.4
SWDIO
  Top 0.254: IC4.19 28.19,4.64 SWLINK.3
TX1
  Top 0.254: IC4.30 37.08,17.53 44.13,10.48 UART1.3

### Text on the board
tNames: GND | GND | GND | EXTERNAL / FUSING / REQUIRED | CANH | CANL | (C) 2026 G MCLELLAN / HW-DEMO03 STM32 | +3V | GND | DIO | CLK | +3V | GND | TX | RX